# Altium schematic sheet 4.Power.SchDoc
size A3; CompanyName: Peets; DrawnBy: Harry Lee; SheetNumber: 5; SheetTotal: 10
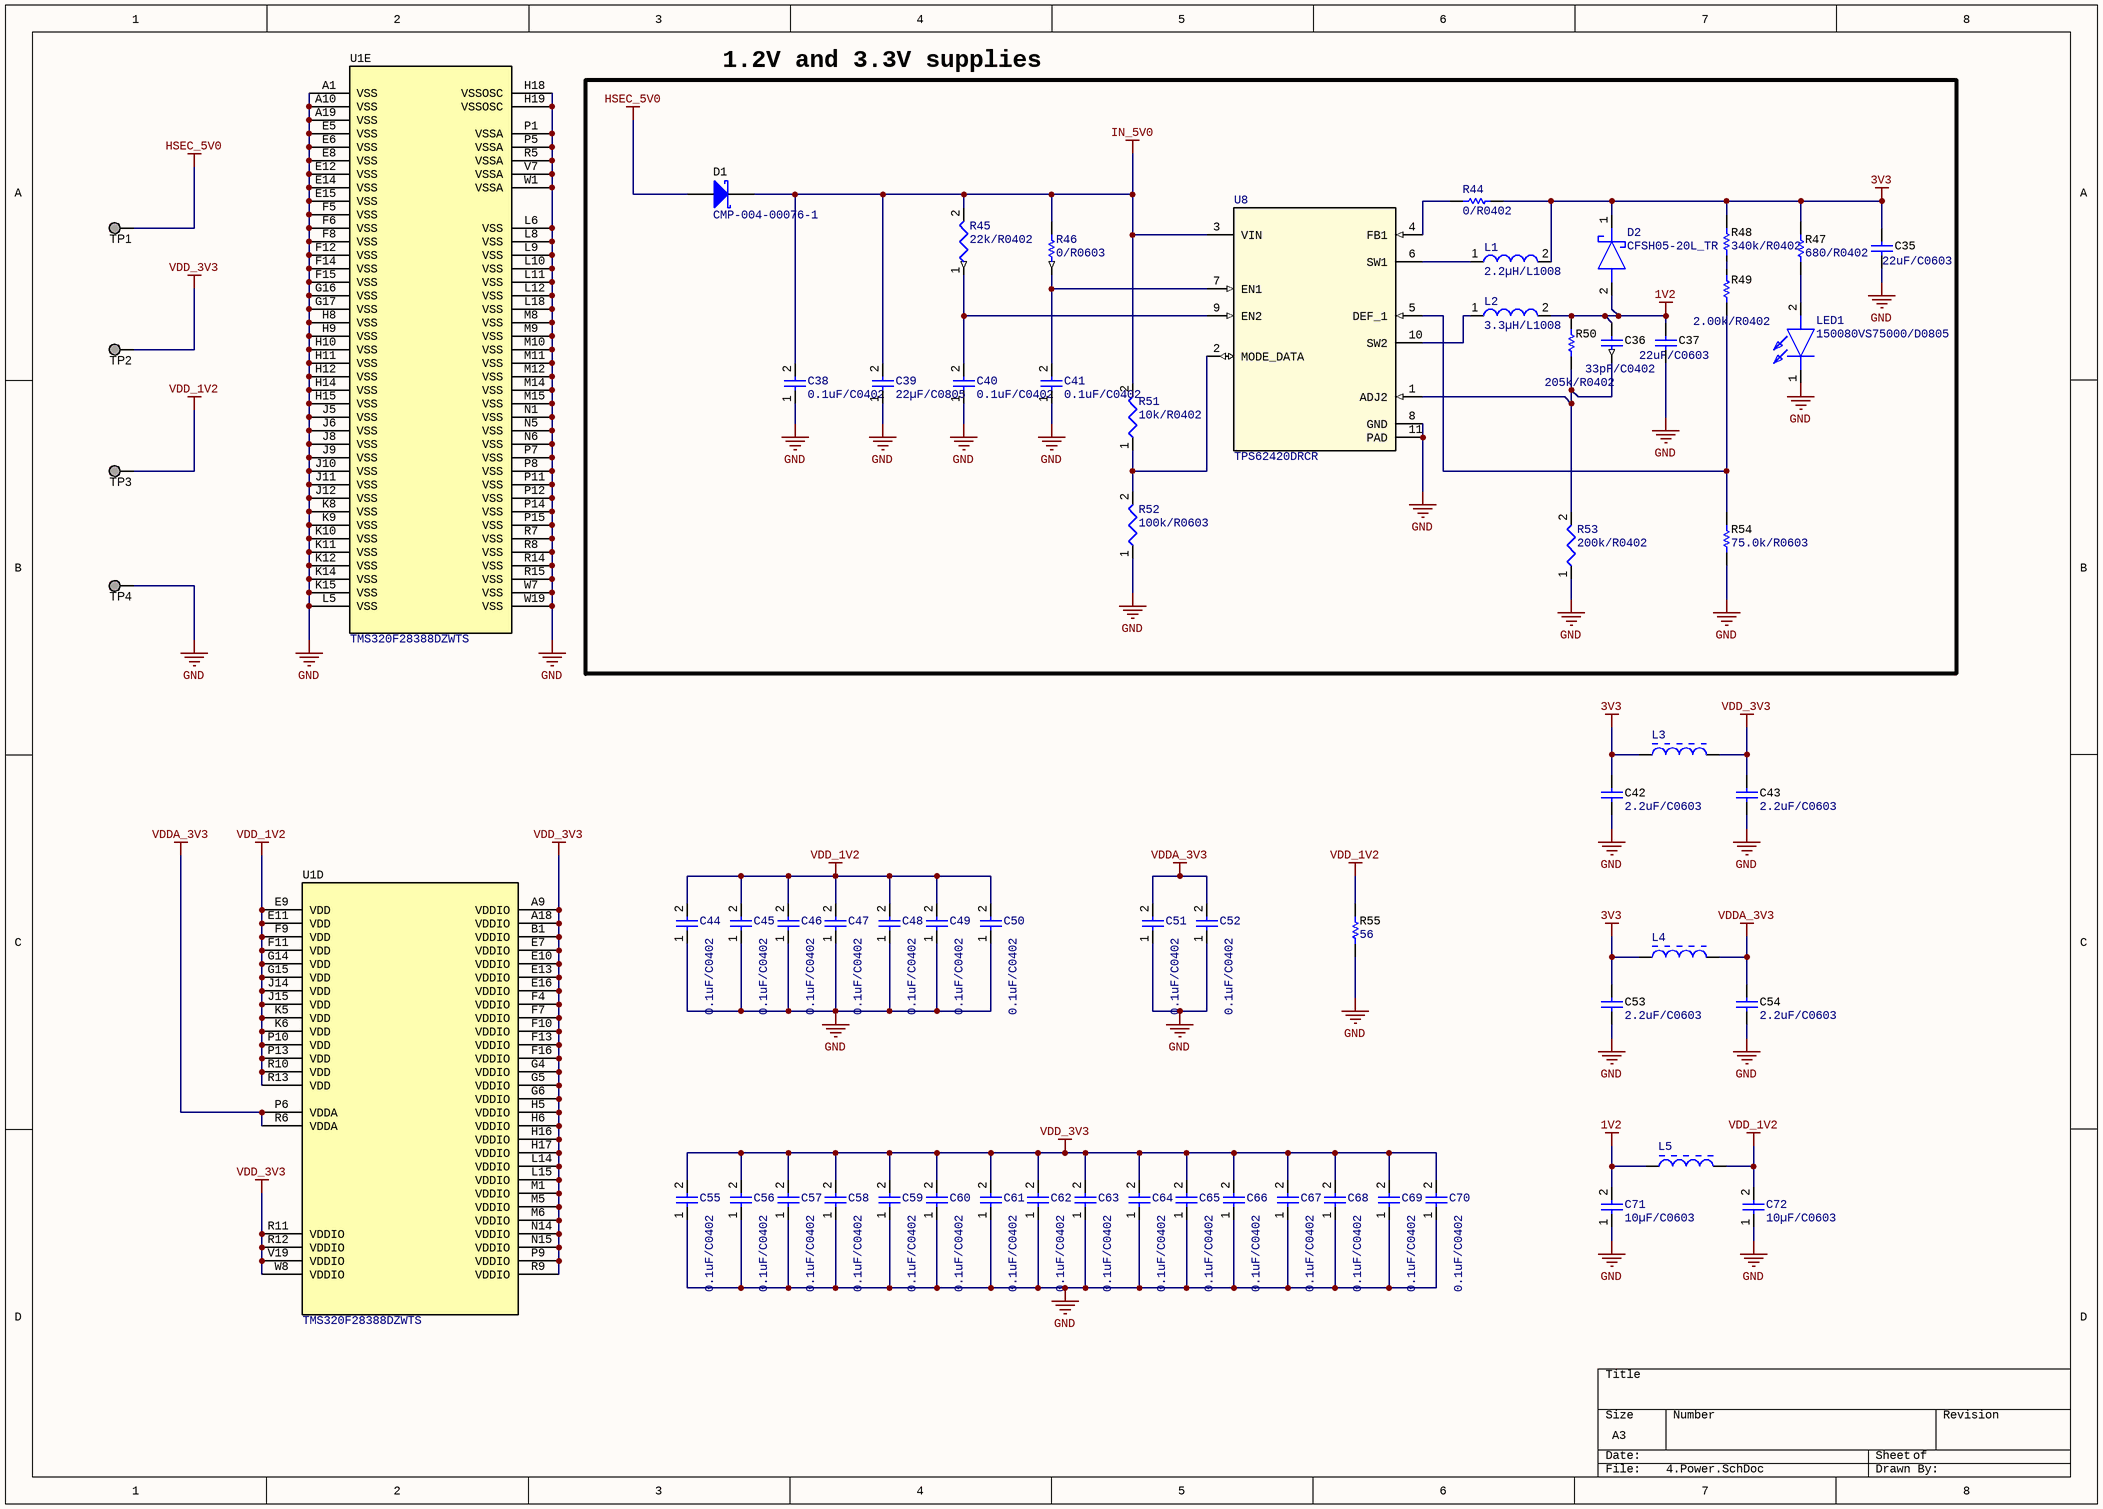
[diagram p0: 4.Power.SchDoc]

## Parts
C35  ValueDisplayed: 22uF/C0603  [0603]  (hidden comment: GRM188R61A226ME15D)
C36  ValueDisplayed: 33pF/C0402  [0402]  (hidden comment: 885012005043)
C37  ValueDisplayed: 22uF/C0603  [0603]  (hidden comment: GRM188R61A226ME15D)
C38  value 0.1uF/C0402  [CAPC1005X56X25LL10T15]  (hidden comment: Capacitor 0.1 uF +/- 5% 16 V 0402)
C39  value 22µF/C0805  [CAPC0805(2012)145_L]  (hidden comment: Capacitor 22µF +/-40% 16V 0805)
C40  value 0.1uF/C0402  [CAPC1005X56X25LL10T15]  (hidden comment: Capacitor 0.1 uF +/- 5% 16 V 0402)
C41  value 0.1uF/C0402  [CAPC1005X56X25LL10T15]  (hidden comment: Capacitor 0.1 uF +/- 5% 16 V 0402)
C42  ValueDisplayed: 2.2uF/C0603  [0603]  (hidden comment: C0603C225K8PACTU)
C43  ValueDisplayed: 2.2uF/C0603  [0603]  (hidden comment: C0603C225K8PACTU)
C44  value 0.1uF/C0402  [CAPC1005X56X25LL10T15]  (hidden comment: Capacitor 0.1 uF +/- 5% 16 V 0402)
C45  value 0.1uF/C0402  [CAPC1005X56X25LL10T15]  (hidden comment: Capacitor 0.1 uF +/- 5% 16 V 0402)
C46  value 0.1uF/C0402  [CAPC1005X56X25LL10T15]  (hidden comment: Capacitor 0.1 uF +/- 5% 16 V 0402)
C47  value 0.1uF/C0402  [CAPC1005X56X25LL10T15]  (hidden comment: Capacitor 0.1 uF +/- 5% 16 V 0402)
C48  value 0.1uF/C0402  [CAPC1005X56X25LL10T15]  (hidden comment: Capacitor 0.1 uF +/- 5% 16 V 0402)
C49  value 0.1uF/C0402  [CAPC1005X56X25LL10T15]  (hidden comment: Capacitor 0.1 uF +/- 5% 16 V 0402)
C50  value 0.1uF/C0402  [CAPC1005X56X25LL10T15]  (hidden comment: Capacitor 0.1 uF +/- 5% 16 V 0402)
C51  value 0.1uF/C0402  [CAPC1005X56X25LL10T15]  (hidden comment: Capacitor 0.1 uF +/- 5% 16 V 0402)
C52  value 0.1uF/C0402  [CAPC1005X56X25LL10T15]  (hidden comment: Capacitor 0.1 uF +/- 5% 16 V 0402)
C53  ValueDisplayed: 2.2uF/C0603  [0603]  (hidden comment: C0603C225K8PACTU)
C54  ValueDisplayed: 2.2uF/C0603  [0603]  (hidden comment: C0603C225K8PACTU)
C55  value 0.1uF/C0402  [CAPC1005X56X25LL10T15]  (hidden comment: Capacitor 0.1 uF +/- 5% 16 V 0402)
C56  value 0.1uF/C0402  [CAPC1005X56X25LL10T15]  (hidden comment: Capacitor 0.1 uF +/- 5% 16 V 0402)
C57  value 0.1uF/C0402  [CAPC1005X56X25LL10T15]  (hidden comment: Capacitor 0.1 uF +/- 5% 16 V 0402)
C58  value 0.1uF/C0402  [CAPC1005X56X25LL10T15]  (hidden comment: Capacitor 0.1 uF +/- 5% 16 V 0402)
C59  value 0.1uF/C0402  [CAPC1005X56X25LL10T15]  (hidden comment: Capacitor 0.1 uF +/- 5% 16 V 0402)
C60  value 0.1uF/C0402  [CAPC1005X56X25LL10T15]  (hidden comment: Capacitor 0.1 uF +/- 5% 16 V 0402)
C61  value 0.1uF/C0402  [CAPC1005X56X25LL10T15]  (hidden comment: Capacitor 0.1 uF +/- 5% 16 V 0402)
C62  value 0.1uF/C0402  [CAPC1005X56X25LL10T15]  (hidden comment: Capacitor 0.1 uF +/- 5% 16 V 0402)
C63  value 0.1uF/C0402  [CAPC1005X56X25LL10T15]  (hidden comment: Capacitor 0.1 uF +/- 5% 16 V 0402)
C64  value 0.1uF/C0402  [CAPC1005X56X25LL10T15]  (hidden comment: Capacitor 0.1 uF +/- 5% 16 V 0402)
C65  value 0.1uF/C0402  [CAPC1005X56X25LL10T15]  (hidden comment: Capacitor 0.1 uF +/- 5% 16 V 0402)
C66  value 0.1uF/C0402  [CAPC1005X56X25LL10T15]  (hidden comment: Capacitor 0.1 uF +/- 5% 16 V 0402)
C67  value 0.1uF/C0402  [CAPC1005X56X25LL10T15]  (hidden comment: Capacitor 0.1 uF +/- 5% 16 V 0402)
C68  value 0.1uF/C0402  [CAPC1005X56X25LL10T15]  (hidden comment: Capacitor 0.1 uF +/- 5% 16 V 0402)
C69  value 0.1uF/C0402  [CAPC1005X56X25LL10T15]  (hidden comment: Capacitor 0.1 uF +/- 5% 16 V 0402)
C70  value 0.1uF/C0402  [CAPC1005X56X25LL10T15]  (hidden comment: Capacitor 0.1 uF +/- 5% 16 V 0402)
C71  value 10µF/C0603  [CAPC0603(1608)100_L]  (hidden comment: Capacitor 10µF +/-20% 10V 0603)
C72  value 10µF/C0603  [CAPC0603(1608)100_L]  (hidden comment: Capacitor 10µF +/-20% 10V 0603)
D1  CMP-004-00076-1  [POWERMITE]
D2  CFSH05-20L_TR  [CFSH0520LTRPBFREE]
L1  value 2.2µH/L1008  [INDC2520X100X60NL20T20]  (hidden comment: LQM2HPN2R2MG0L)
L2  value 3.3µH/L1008  [INDC2520X100X60NL20T20]  (hidden comment: LQM2HPN2R2MG0L)
L3  BLM18AG121SN1D  [MURA-BLM18-F-H1-CHIP-2_V]  (value not drawn)
L4  BLM18AG121SN1D  [MURA-BLM18-F-H1-CHIP-2_V]  (value not drawn)
L5  BLM18AG121SN1D  [MURA-BLM18-F-H1-CHIP-2_V]  (value not drawn)
LED1  150080VS75000/D0805  [LEDC2012X70N]
R44  value 0/R0402  [RESC1005X40X25ML05T05]  (hidden comment: Resistor 0R +/- 5% 0402 100 mW)
R45  value 22k/R0402  [RESC0402(1005)_L]  (hidden comment: 22KR2F)
R46  value 0/R0603  [RESC1608X55X25ML10T15]  (hidden comment: Resistor 0R +/- 5% 0603 100 mW)
R47  ValueDisplayed: 680/R0402  [0402]  (hidden comment: CRCW0402680RJNED)
R48  ValueDisplayed: 340k/R0402  [0402]  (hidden comment: CRCW0402340KFKED)
R49  ValueDisplayed: 2.00k/R0402  [0402]  (hidden comment: ERJ-2RKF2001X)
R50  ValueDisplayed: 205k/R0402  [0402]  (hidden comment: CRCW0402205KFKED)
R51  value 10k/R0402  [RESC0402(1005)_L]  (hidden comment: 10KR2F)
R52  value 100k/R0603  [RESC1608X55X25ML10T15]  (hidden comment: Resistor 100k +/-1% 0603 100 mW)
R53  value 200k/R0402  [RESC0402(1005)_L]  (hidden comment: Resistor 200K +/-1 % 0402 63 mW)
R54  ValueDisplayed: 75.0k/R0603  [0603]  (hidden comment: RT0603DRE0775KL)
R55  ValueDisplayed: 56  [0402]  (hidden comment: CRCW040256R0JNED)
TP1  TESTPOINT  [TP_50MIL-25MILHOLE]  (value not drawn)  (no BOM)
TP2  TESTPOINT  [TP_50MIL-25MILHOLE]  (value not drawn)  (no BOM)
TP3  TESTPOINT  [TP_50MIL-25MILHOLE]  (value not drawn)  (no BOM)
TP4  TESTPOINT  [TP_50MIL-25MILHOLE]  (value not drawn)  (no BOM)
U1  TMS320F28388DZWTS  [ZWT0337A-IPC_B]  (parts D,E of 5)
U8  TPS62420DRCR  [DRC0010J]

## Nets
1V2: C36.1 C37.1 C71.2 D2.2(A) L2.2 L5.1 R50.2
3V3: C35.1 C42.1 C53.1 D2.1(K) L1.2 L3.1 L4.1 R44.2 R47.2 R48.2
GND: C35.2 C37.2 C38.1 C39.1 C40.1 C41.1 C42.2 C43.2 C44.1 C45.1 C46.1 C47.1 C48.1 C49.1 C50.1 C51.1 C52.1 C53.2 C54.2 C55.1 C56.1 C57.1 C58.1 C59.1 C60.1 C61.1 C62.1 C63.1 C64.1 C65.1 C66.1 C67.1 C68.1 C69.1 C70.1 C71.1 C72.1 LED1.1(K) R52.1 R53.1 R54.1 R55.1 TP4.1 U1.A1(VSS) U1.A10(VSS) U1.A19(VSS) U1.E5(VSS) U1.E6(VSS) U1.E8(VSS) U1.E12(VSS) U1.E14(VSS) U1.E15(VSS) U1.F5(VSS) U1.F6(VSS) U1.F8(VSS) U1.F12(VSS) U1.F14(VSS) U1.F15(VSS) U1.G16(VSS) U1.G17(VSS) U1.H8(VSS) U1.H9(VSS) U1.H10(VSS) U1.H11(VSS) U1.H12(VSS) U1.H14(VSS) U1.H15(VSS) U1.H18(VSSOSC) U1.H19(VSSOSC) U1.J5(VSS) U1.J6(VSS) U1.J8(VSS) U1.J9(VSS) U1.J10(VSS) U1.J11(VSS) U1.J12(VSS) U1.K8(VSS) U1.K9(VSS) U1.K10(VSS) U1.K11(VSS) U1.K12(VSS) U1.K14(VSS) U1.K15(VSS) U1.L5(VSS) U1.L6(VSS) U1.L8(VSS) U1.L9(VSS) U1.L10(VSS) U1.L11(VSS) U1.L12(VSS) U1.L18(VSS) U1.M8(VSS) U1.M9(VSS) U1.M10(VSS) U1.M11(VSS) U1.M12(VSS) U1.M14(VSS) U1.M15(VSS) U1.N1(VSS) U1.N5(VSS) U1.N6(VSS) U1.P1(VSSA) U1.P5(VSSA) U1.P7(VSS) U1.P8(VSS) U1.P11(VSS) U1.P12(VSS) U1.P14(VSS) U1.P15(VSS) U1.R5(VSSA) U1.R7(VSS) U1.R8(VSS) U1.R14(VSS) U1.R15(VSS) U1.V7(VSSA) U1.W1(VSSA) U1.W7(VSS) U1.W19(VSS) U8.8(GND) U8.11(PAD)
HSEC_5V0: D1.2(A) TP1.1
IN_5V0: C38.2 C39.2 D1.1(K) R45.2 R46.2 R51.2 U8.3(VIN)
VDD_1V2: C44.2 C45.2 C46.2 C47.2 C48.2 C49.2 C50.2 C72.2 L5.2 R55.2 TP3.1 U1.E9(VDD) U1.E11(VDD) U1.F9(VDD) U1.F11(VDD) U1.G14(VDD) U1.G15(VDD) U1.J14(VDD) U1.J15(VDD) U1.K5(VDD) U1.K6(VDD) U1.P10(VDD) U1.P13(VDD) U1.R10(VDD) U1.R13(VDD)
VDD_3V3: C43.1 C55.2 C56.2 C57.2 C58.2 C59.2 C60.2 C61.2 C62.2 C63.2 C64.2 C65.2 C66.2 C67.2 C68.2 C69.2 C70.2 L3.2 TP2.1 U1.A9(VDDIO) U1.A18(VDDIO) U1.B1(VDDIO) U1.E7(VDDIO) U1.E10(VDDIO) U1.E13(VDDIO) U1.E16(VDDIO) U1.F4(VDDIO) U1.F7(VDDIO) U1.F10(VDDIO) U1.F13(VDDIO) U1.F16(VDDIO) U1.G4(VDDIO) U1.G5(VDDIO) U1.G6(VDDIO) U1.H5(VDDIO) U1.H6(VDDIO) U1.H16(VDDIO) U1.H17(VDDIO) U1.L14(VDDIO) U1.L15(VDDIO) U1.M1(VDDIO) U1.M5(VDDIO) U1.M6(VDDIO) U1.N14(VDDIO) U1.N15(VDDIO) U1.P9(VDDIO) U1.R9(VDDIO) U1.R11(VDDIO) U1.R12(VDDIO) U1.V19(VDDIO) U1.W8(VDDIO)
VDDA_3V3: C51.2 C52.2 C54.1 L4.2 U1.P6(VDDA) U1.R6(VDDA)
NetC36_2: C36.2 R50.1 R53.2 U8.1(ADJ2)
NetC40_2: C40.2 R45.1 U8.9(EN2)
NetC41_2: C41.2 R46.1 U8.7(EN1)
NetL1_1: L1.1 U8.6(SW1)
NetL2_1: L2.1 U8.10(SW2)
NetLED1_2: LED1.2(A) R47.1
NetR44_1: R44.1 U8.4(FB1)
NetR48_1: R48.1 R49.2
NetR49_1: R49.1 R54.2 U8.5(DEF_1)
NetR51_1: R51.1 R52.2 U8.2(MODE_DATA)

## Notes on the sheet
- 1.2V and 3.3V supplies

## Library data of the parts
C35 C37 = CMP-0007324-5: CAP, CERM, 22 uF, 10 V, +/- 20%, X5R, 0603; Manufacturer: MuRata; TaMin_C: -55°C; Polarized: N; SizeAreaWB_mm2: 4.68; Value1: Unknown; U/M: EA; Value: 22uF; TaMax_C: 85°C; SizeZ_mm: 1; SizeX_mm: 1.6; SizeY_mm: 0.8; Value2: 10V; SizeArea_mm2: 1.28; CompType: Capacitor; Cap_F: 22µF; AEC Category: Q200; Supplier Part Number 2: 68X2786; Publisher: Texas Instruments; Supplier 2: Newark; Supplier Part Number 3: 81-GRM188R61A226ME5D; TempCo: X5R; Supplier 3: Mouser; Published: 2008-06-19; RoHS: Y; MountType: SMT; Supplier 1: Digi-Key; PackageReference: 0603; Tolerance_%: 20%; Cap_Case: 0603; LatestRevisionDate: 2017-03-09; PartNumber: GRM188R61A226ME15D; AEC Qualified: ?; ComponentLink1Description: Datasheet link; Supplier Part Number 1: 490-10476-1-ND; Technology: Ceramic; ComponentLink1URL: http://psearch.murata.com/capacitor/product/GRM188R61A226ME15%23.pdf
C36 = CMP-0006213-2: CAP, CERM, 33 pF, 25 V, +/- 5%, C0G/NP0, 0402; Manufacturer: Wurth Elektronik; TaMin_C: -55°C; Polarized: N; SizeAreaWB_mm2: 3; Value1: Unknown; U/M: EA; Value: 33pF; TaMax_C: 125°C; SizeZ_mm: 0.6; SizeX_mm: 1; SizeY_mm: 0.5; Value2: 25V; CompType: Capacitor; AEC Category: Q200; Publisher: Texas Instruments; TempCo: C0G/NP0; Published: 2008-06-19; RoHS: Y; MountType: SMT; Supplier 1: Mouser; PackageReference: 0402; Tolerance_%: 5%; Cap_Case: 0402; SizeArea_mm2: 0.5; LatestRevisionDate: 2017-03-09; PartNumber: 885012005043; AEC Qualified: N; Cap_F: 33pF; ComponentLink1Description: Datasheet link; Supplier Part Number 1: 710-885012005043; Technology: Ceramic; ComponentLink1URL: http://katalog.we-online.de/pbs/datasheet/885012005043.pdf; AEC Grade: N/A; VDC_V: 25V
C38 C40 C41 C44-C52 C55-C70 = CMP-001-00001-6: Chip Capacitor, 0.1 uF, +/- 5%, 16 V, 0402 (1005 Metric); Capacitor Type: Ceramic; Voltage Rating: 16V; Max Operating Temperature: 125°C; Min Operating Temperature: -55°C; Case/Package: 0402; Mounting Technology: SM; Pins: 2; Tolerance: 5%; RoHS Compliant: True
C39 = CMP-001-00081-4: Chip Capacitor, 22µF +/-40%, 16V, 0805, Thickness 1.45 mm; Tolerance: 5%; Voltage Rating: 16V; Mounting Technology: SMT; Pins: 2; Max Operating Temperature: 85°C; Case/Package: 0805; Min Operating Temperature: -55°C
C42 C43 C53 C54 = CMP-0006906-5: CAP, CERM, 2.2 uF, 10 V, +/- 10%, X5R, 0603; Manufacturer: Kemet; TaMin_C: -55°C; Polarized: N; SizeAreaWB_mm2: 4.68; Value1: Unknown; U/M: EA; Value: 2.2uF; TaMax_C: 85°C; SizeZ_mm: 1; SizeX_mm: 1.6; SizeY_mm: 0.8; Value2: 10V; SizeArea_mm2: 1.28; CompType: Capacitor; Cap_F: 2.2µF; AEC Category: Q200; Supplier Part Number 2: 80-C0603C225K8P; Publisher: Texas Instruments; Supplier 2: Mouser; Supplier Part Number 3: 1108322; TempCo: X5R; Supplier 3: Farnell; Published: 2008-06-19; RoHS: Y; MountType: SMT; Supplier 1: Digi-Key; PackageReference: 0603; Tolerance_%: 10%; Cap_Case: 0603; LatestRevisionDate: 2017-03-09; PartNumber: C0603C225K8PACTU; AEC Qualified: ?; ComponentLink1Description: Datasheet link; Supplier Part Number 1: 399-4911-1-ND; Technology: Ceramic; ComponentLink1URL: http://www.kemet.com/kemet/web/homepage/kechome.nsf/vapubfiles/F3102_Y5V.pdf/$file/F3102_Y5V.pdf
C71 C72 = CMP-001-00075-4: Chip Capacitor, 10µF +/-20%, 10V, 0603, Thickness 1 mm; Tolerance: 10%; Voltage Rating: 10V; Max Operating Temperature: 85°C; Pins: 2; Case/Package: 0603; Mounting Technology: SMT; Min Operating Temperature: -55°C
D1 = CMP-004-00076-1: Diode, Schottky, 10 V, 1 A, AEC-Q101, POWERMITE; PartNumber: MBRM110ET1G; Manufacturer: ON Semiconductor; Vf_V: 530mV; VALUE: 10V; Green_REACh: Incomplete; Io_A: 1A; SizeZ_mm: 1.15; AEC Category: Q101; SizeX_mm: 3.9; AEC Qualified: Y; Value2: 0.53V; SizeAreaWB_mm2: 14.945; SizeArea_mm2: 7.995; Tjmax_C: 150°C; Green_Lifecycle: Not Set; SizeY_mm: 2.05; Available Preview Images: 2D; ComponentLink1Description: Datasheet link; Vr_V: 10V; MountType: SMT; Value1: 1A; CompType: Diode; Green_EU RoHS: Incomplete; Green_EU RoHS-2: Incomplete; ComponentLink1URL: http://www.onsemi.com/pub_link/Collateral/MBRM110E-D.PDF; RoHS: Y; Type: Schottky; Source: MCU063B.SCHLIB; Case/Package: POWERMITE; Design Item ID: CMP-0028747-2
D2 = CMP-004-00069-1: SURFACE MOUNT SILICON LOW VF SCHOTTKY DIODE 0.5 AMP; Manufacturer_Name: Central Semiconductor; Manufacturer_Part_Number: CFSH05-20L TR PBFREE; Source: SamacSys.SchLib; Arrow Price/Stock: https://www.arrow.com/en/products/cfsh05-20ltrpbfree/central-semiconductor?region=nac; Datasheet Link: https://my.centralsemi.com/get_document.php?cmp=1&mergetype=pd&mergepath=pd&pdf_id=CFSH05-20L.PDF; Arrow Part Number: CFSH05-20L TR PBFREE; Design Item ID: CFSH05-20L_TR_PBFREE; Height: 0.4mm; Mouser Price/Stock: https://www.mouser.co.uk/ProductDetail/Central-Semiconductor/CFSH05-20L-TR-PBFREE?qs=u16ybLDytRbLc8US0gUlgw%3D%3D; Mouser Part Number: 610-CFSH05-20LTR
L1 L2 = CMP-006-00009-6: Chip Inductor, 2.2 uH, +/- 20%, -55 to 125 degC, 1008 (2520 Metric), RoHS, Tape and Reel; Manufacturer: Murata; Self Resonant Frequency: 40MHz; Current Rating: 1.3A; Core Material: Ferrite; Shielding: Shielded; Package Description: 2-Pin Surface Mounted Device, Body 2.5 x 2 mm; Tolerance: 20%; Max Operating Temperature: 125°C; Mounting Technology: SM; Package Reference: 1008; Case/Package: 1008; RoHS Compliant: True; Package Quantity: 3000; Packaging: TapeandReel; Min Operating Temperature: -55°C; Datasheet URL: http://psearch.en.murata.com/inductor/product/LQM2HPN2R2MG0%23.pdf; Datasheet Version: Aug-16
L3-L5 = CMP-006-00004-3: Chip Ferrite Bead for General Use, 120 Ohm, 500 mA, -55 to 125 degC, 0603 (1608 Metric), RoHS, Tape and Reel; Manufacturer: Murata; Max Current Rating: 500mA; Tolerance: 25%; Impedance: 120Ohm; Resistance: 200mohm; Min Operating Temperature: -55°C; Package Reference: BLM18_H950-2; Max Operating Temperature: 125°C; Current Rating: 500mA; Core Material: Ferrite; Datasheet Version: Jun-12; Packaging: TapeandReel; Datasheet URL: https://statics3.seeedstudio.com/images/opl/datasheet/303010016.pdf; Package Quantity: 4000; Case/Package: 0603; RoHS Compliant: True
LED1 = CMP-007-00038-1: WL-SMCW SMT Mono-Color Chip LED Waterclear 0805; Manufacturer_Name: Wurth Elektronik; Datasheet Link: https://www.we-online.com/components/products/download/Download_3D_150080VS75000+%28rev1%29.pdf; Manufacturer_Part_Number: 150080VS75000; Mouser Price/Stock: https://www.mouser.co.uk/ProductDetail/Wurth-Elektronik/150080VS75000?qs=LlUlMxKIyB0tGHJmO6%252B0ug%3D%3D; Source: SamacSys.SchLib; Design Item ID: 150080VS75000; Height: 0.7mm; Mouser Part Number: 710-150080VS75000
R44 = CMP-009-00005-5: Chip Resistor, 0 Ohm, 0.1 W, -55 to 155 degC, 0402 (1005 Metric); Power: 100mW; Voltage Rating: 50V; Pins: 2; Tolerance: 5%; Case/Package: 0402; Mounting Technology: SM; Max Operating Temperature: 155°C; Min Operating Temperature: -55°C; RoHS Compliant: True
R45 = CMP-009-00081-2: 22K 0.063W 1% 0402 (1005 Metric)  SMD; Power: 63mW; Tolerance: 1%; Pins: 2; Mounting Technology: SMT; Case/Package: 0402
R46 = CMP-009-00006-5: Chip Resistor, 0 Ohm, 0.1 W, -55 to 155 degC, 0603 (1608 Metric); Power: 100mW; Voltage Rating: 50V; Max Operating Temperature: 155°C; RoHS Compliant: True; Mounting Technology: SM; Case/Package: 0603; Min Operating Temperature: -55°C; Tolerance: 5%; Pins: 2
R47 = CMP-0026962-3: RES, 680, 5%, 0.063 W, AEC-Q200 Grade 0, 0402; Manufacturer: Vishay-Dale; CompType: Resistor; Value: 680; Value_Code: 680R; Power_W: 63mW; Value2: 0.063W; VDC_V: 50V; TempCo: 200 ppm/C; EIA_Code: E24; AEC Category: Q200; AEC Qualified: Y; AEC Grade: 0; SizeArea_mm2: 0.5; SizeX_mm: 1; SizeZ_mm: 0.6; PartNumber: CRCW0402680RJNED; PackageReference: 0402; RoHS: E; Res_ohm: 680; Tolerance_%: 5%; Value1: 5%; MountType: SMT; Technology: Thick Film; ComponentLink1Description: Datasheet link; ComponentLink1URL: http://www.vishay.com/docs/20035/dcrcwe3.pdf; Supplier 1: Digi-Key; Supplier Part Number 1: 541-680JCT-ND; Supplier 2: Newark; Supplier Part Number 2: 59M6744; Supplier 3: Mouser; Supplier Part Number 3: 71-CRCW0402J-680-E3; SizeY_mm: 0.5
R48 = CMP-0026300-2: RES, 340 k, 1%, 0.063 W, AEC-Q200 Grade 0, 0402; Manufacturer: Vishay-Dale; Power_W: 63mW; TempCo: 100 ppm/C; Value_Code: 340k; Value: 340k; EIA_Code: E96; SizeX_mm: 1; SizeY_mm: 0.5; SizeZ_mm: 0.6; Value2: 0.063W; CompType: Resistor; AEC Qualified: Y; VDC_V: 50V; AEC Category: Q200; AEC Grade: 0; ComponentLink1URL: http://www.vishay.com/docs/20035/dcrcwe3.pdf; Supplier Part Number 2: 52K6992; Supplier 2: Newark; Supplier Part Number 3: 71-CRCW0402-340K-E3; Supplier 3: Mouser; RoHS: E; Value1: 1%; MountType: SMT; Supplier 1: Digi-Key; PackageReference: 0402; Tolerance_%: 1%; Res_ohm: 340k; SizeArea_mm2: 0.5; PartNumber: CRCW0402340KFKED; ComponentLink1Description: Datasheet link; Supplier Part Number 1: 541-340KLCT-ND; Technology: Thick Film
R49 = CMP-0026676-1: RES, 2.00 k, 1%, 0.1 W, AEC-Q200 Grade 0, 0402; Manufacturer: Panasonic; Power_W: 100mW; TempCo: 100 ppm/C; Value_Code: 2k00; U/M: EA; Value: 2.00k; EIA_Code: E96; Res_ohm: 2k; SizeX_mm: 1; SizeY_mm: 0.5; SizeZ_mm: 0.6; Value2: 0.1W; CompType: Resistor; AEC Qualified: Y; VDC_V: 50V; AEC Grade: 0; AEC Category: Q200; ComponentLink1URL: http://industrial.panasonic.com/cdbs/www-data/pdf/RDA0000/AOA0000C86.pdf; Supplier Part Number 2: 73T6486; Publisher: Texas Instruments; Supplier 2: Newark; Supplier Part Number 3: 667-ERJ-2RKF2001X; Supplier 3: Mouser; Published: 2008-06-26; RoHS: Y; Value1: 1%; MountType: SMT; Supplier 1: Digi-Key; PackageReference: 0402; Tolerance_%: 1%; SizeArea_mm2: 0.5; LatestRevisionDate: 2017-03-09; PartNumber: ERJ-2RKF2001X; ComponentLink1Description: Datasheet link; Supplier Part Number 1: P2.00KLCT-ND; Technology: Thick Film
R50 = CMP-0026160-2: RES, 205 k, 1%, 0.063 W, AEC-Q200 Grade 0, 0402; Manufacturer: Vishay-Dale; Power_W: 63mW; TempCo: 100 ppm/C; Value_Code: 205k; Value: 205k; EIA_Code: E96; SizeX_mm: 1; SizeY_mm: 0.5; SizeZ_mm: 0.6; Value2: 0.063W; CompType: Resistor; AEC Qualified: Y; VDC_V: 50V; AEC Category: Q200; AEC Grade: 0; ComponentLink1URL: http://www.vishay.com/docs/20035/dcrcwe3.pdf; Supplier Part Number 2: 52K6827; Supplier 2: Newark; Supplier Part Number 3: 71-CRCW0402-205K-E3; Supplier 3: Mouser; RoHS: E; Value1: 1%; MountType: SMT; Supplier 1: Digi-Key; PackageReference: 0402; Tolerance_%: 1%; Res_ohm: 205k; SizeArea_mm2: 0.5; PartNumber: CRCW0402205KFKED; ComponentLink1Description: Datasheet link; Supplier Part Number 1: 541-205KLCT-ND; Technology: Thick Film
R51 = CMP-009-00066-2: 10K 0.063W 1% 0402 (1005 Metric)  SMD; Power: 63mW; Case/Package: 0402; Mounting Technology: SMT; Pins: 2; Tolerance: 1%
R52 = CMP-009-00023-5: Chip Resistor, 100 KOhm, +/- 1%, 0.1 W, -55 to 155 degC, 0603 (1608 Metric); Voltage Rating: 50V; Power: 100mW; Max Operating Temperature: 155°C; RoHS Compliant: True; Tolerance: 1%; Pins: 2; Case/Package: 0603; Mounting Technology: SM; Min Operating Temperature: -55°C
R53 = CMP-009-00163-3: Chip Resistor, 200 kOhms, +/-1 %, 63 mW, -55 to 155 degC, 0402; Power: 63mW; Tolerance: 1%; Min Operating Temperature: -55°C; Max Operating Temperature: 155°C; Case/Package: 0402; Pins: 2
R54 = CMP-0025557-3: RES, 75.0 k, 0.5%, 0.1 W, 0603; Manufacturer: Yageo America; Power_W: 100mW; TempCo: 50 ppm/C; Value_Code: 75k0; U/M: EA; Value: 75.0k; EIA_Code: E192; Res_ohm: 75k; SizeX_mm: 1.6; SizeY_mm: 0.8; SizeZ_mm: 1; Value2: 0.1W; SizeArea_mm2: 1.28; CompType: Resistor; VDC_V: 75V; AEC Category: Q200; Publisher: Texas Instruments; Published: 2008-06-26; RoHS: Y; Value1: 0.5%; MountType: SMT; PackageReference: 0603; Tolerance_%: 0.5%; LatestRevisionDate: 2017-03-09; PartNumber: RT0603DRE0775KL; AEC Qualified: ?; ComponentLink1Description: Datasheet link; Technology: Thin Film; ComponentLink1URL: http://www.yageo.com/pdf/PYu-RT_1-to-0.05_RoHS_L_3.pdf
R55 = CMP-0026950-3: RES, 56, 5%, 0.063 W, AEC-Q200 Grade 0, 0402; Manufacturer: Vishay-Dale; Power_W: 63mW; TempCo: 200 ppm/C; Value_Code: 56R0; Value: 56; EIA_Code: E24; SizeX_mm: 1; SizeY_mm: 0.5; SizeZ_mm: 0.6; Value2: 0.063W; CompType: Resistor; AEC Qualified: Y; VDC_V: 50V; AEC Category: Q200; AEC Grade: 0; Supplier Part Number 2: 89M6681; Supplier 2: Newark; Supplier Part Number 3: 71-CRCW0402J-56-E3; Supplier 3: Mouser; RoHS: E; Value1: 5%; MountType: SMT; Supplier 1: Digi-Key; PackageReference: 0402; Tolerance_%: 5%; Res_ohm: 56; SizeArea_mm2: 0.5; PartNumber: CRCW040256R0JNED; ComponentLink1Description: Datasheet link; Supplier Part Number 1: 541-56JCT-ND; Technology: Thick Film; ComponentLink1URL: http://www.vishay.com/docs/20035/dcrcwe3.pdf
TP1-TP4 = CMP-0078143-3: TEST POINT.  No entry in BOM.; CompType: Testpoint; PackageReference: N/A; Manufacturer: N/A; PartNumber: N/A; Library Reference: TESTPOINT
U1 = CMP-012-000147-1: TMS320F28388DZWTS, ZWT0337A (NFBGA-337); Alternate Manufacturer: Texas Instruments; SizeY_mm: 16; SizeArea_mm2: 256; AEC Qualified: N; SizeAreaWB_mm2: 324; SizeZ_mm: 1.4; Available Preview Images: 2D; CompType: IC; AEC Category: Q200; ComponentLink2URL: http://www.ti.com/product/tms320f28388d; MountType: SMT; ComponentLink3Description: Online Datasheet; PackageDescription: NFBGA-337; ComponentLink3URL: http://www.ti.com/product/tms320f28388d/datasheet; SizeX_mm: 16; Design Item ID: TMS320F28388DZWTS; ComponentLink1URL: http://www.ti.com/lit/ds/symlink/tms320f28388d.pdf; Source: SamacSys.SchLib; ComponentLink2Description: Product Folder; PackageReference: ZWT0337A; Manufacturer: Texas Instruments; ComponentLink1Description: Datasheet Link
U8 = CMP-014-000012-1: Dual, Adjustable, 600mA and 1000mA, 2.25MHz Step-Down Converter with 1-Wire Interface in QFN 10-VSON -40 to 85; Manufacturer: Texas Instruments; Alternate_PartNumber: TPS62420DRCT; CompType: IC; RefDes: RefDes; TYPE: TYPE; Source: SamacSys.SchLib; PartNumber: TPS62420DRCR; MountType: SMT; Copyright: Copyright (C) 2025 Ultra Librarian. All rights reserved.; RoHS: Y; Application_BuildNumber: *; Manufacturer_Name: Texas Instruments; Design Item ID: TPS62420DRCR; Manufacturer_Part_Number: TPS62420DRCR; PackageReference: DRC0010J